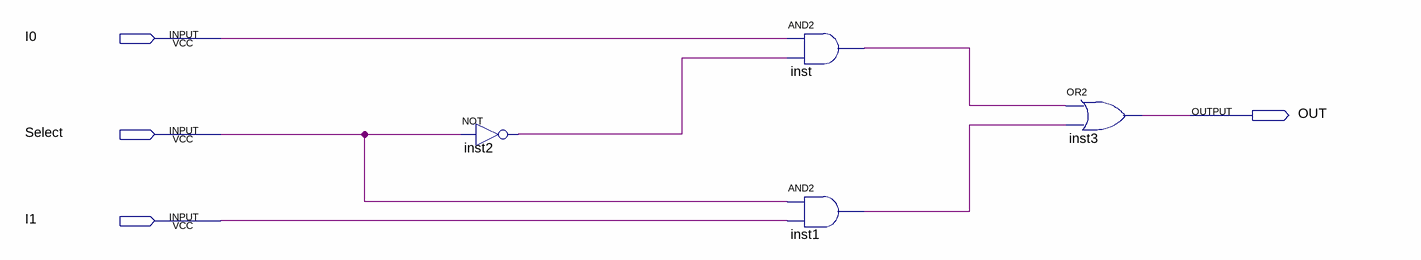
[diagram p0: schematic sheet]
// Quartus schematic mux21.bdf as structural Verilog: 4 symbols, 4 pins
module mux21 (
  input  I0,
  input  Select,
  input  I1,
  output OUT
);

  wire inst1_out, inst2_out, inst_out;

  not inst2 (inst2_out, Select);
  and inst (inst_out, I0, inst2_out);
  and inst1 (inst1_out, Select, I1);
  or inst3 (OUT, inst_out, inst1_out);
endmodule
